# Altium schematic sheet Mic_preamp_schematic.SchDoc
size A4
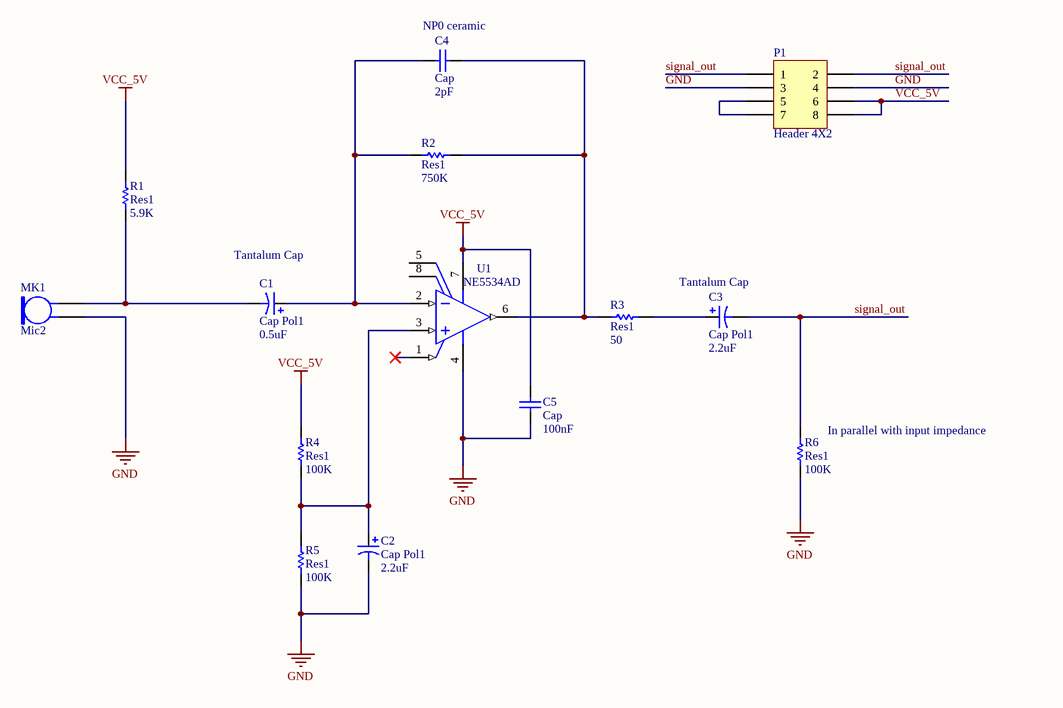
[diagram p0: Mic_preamp_schematic.SchDoc]

## Parts
C1  Cap Pol1  value 0.5uF  [CAPC3216X175N]
C2  Cap Pol1  value 2.2uF  [CAPC3216X175N]
C3  Cap Pol1  value 2.2uF  [CAPC3216X175N]
C4  Cap  value 2pF  [CAPC2012X135N]
C5  Cap  value 100nF  [CAPC2012X135N]
MK1  Mic2  [LD-MC-6035P]
P1  Header 4X2  [HDR2X4]
R1  Res1  value 5.9K  [RESC2012X70N]
R2  Res1  value 750K  [RESC2012X70N]
R3  Res1  value 50  [RESC2012X70N]
R4  Res1  value 100K  [RESC2012X70N]
R5  Res1  value 100K  [RESC2012X70N]
R6  Res1  value 100K  [RESC2012X70N]
U1  NE5534AD  [TI-D8_N]

## Nets
GND: C2.2 C5.1 MK1.1 P1.3 P1.4 R5.2 R6.1 U1.4(VCC-)
VCC_5V: C5.2 P1.6 P1.8 R1.2 R4.1 U1.7(VCC+)
signal_out: C3.2 P1.1 P1.2 R6.2
NetC1_1: C1.1 C4.1 R2.2 U1.2(IN-)
NetC1_2: C1.2 MK1.2 R1.1
NetC2_1: C2.1 R4.2 R5.1 U1.3(IN+)
NetC3_1: C3.1 R3.1
NetC4_2: C4.2 R2.1 R3.2 U1.6(OUT)
NetP1_5: P1.5 P1.7

Not connected (* = marked no-connect by the designer): U1 1(BALANCE)* 5(COMP) 8(COMP/BAL)

## Notes on the sheet
- (near C4) NP0 ceramic
- (near C1) Tantalum Cap
- (near C3) Tantalum Cap
- (near R6) In parallel with input impedance

## Library data of the parts
C1-C3 = Cap Pol1: Polarized Capacitor (Radial); Published: 8-Jun-2000; LatestRevisionDate: 17-Jul-2002; LatestRevisionNote: Re-released for DXP Platform.; PackageReference: RB7.6-15; Publisher: Altium Limited; PackageDescription: Polarized Capacitor (Radial); 2 Leads
C4 C5 = Cap: Capacitor; Published: 8-Jun-2000; LatestRevisionDate: 17-Jul-2002; LatestRevisionNote: Re-released for DXP Platform.; PackageReference: RAD-0.3; Publisher: Altium Limited; PackageDescription: Radial Cap, Thru-Hole; 2 Leads; 0.3 in Pin Spacing
MK1 = Mic2: Microphone; Published: 24-Mar-1999; LatestRevisionDate: 17-Jul-2002; LatestRevisionNote: Re-released for DXP Platform.; PackageReference: PIN2; Publisher: Altium Limited
P1 = Header 4X2: Header, 4-Pin, Dual row; LatestRevisionDate: 17-Jul-2002; LatestRevisionNote: Re-released for DXP Platform.; Publisher: Altium Limited
R1-R6 = Res1: Resistor; Published: 8-Jun-2000; LatestRevisionDate: 17-Jul-2002; LatestRevisionNote: Re-released for DXP Platform.; PackageReference: AXIAL-0.3; Publisher: Altium Limited; PackageDescription: Axial Device, Thru-Hole; 2 Leads; 0.3 in Pin Spacing
U1 = NE5534AD: Low-Noise Operational Amplifier, 10 to 30 V, 0 to 70 degC, 8-pin SOIC (D8), Green (RoHS & no Sb/Br); Manufacturer: Texas Instruments; CMRR(Min)(dB): 70; GBW(Typ)(MHz): 10; IIB(Max)(pA): 1500000; Iq per channel(Max)(mA): 8; Number of Channels: 1; Slew Rate(Typ)(V/us): 13; Sub Family: General Purpose Amplifier, High Supply Voltage Amplifier (>=30V), Low Noise Amp (<=10nV/rtHz); Total Supply Voltage(Max)(+5V is 5, +/-5V is 10): 30; Total Supply Voltage(Min)(+5V is 5, +/-5V is 10): 3.3; Vio (25C)(Max)(mV): 4; Vn at 1kHz(Typ)(nV/rtHz): 3.5; DatasheetVersion: SLOS070C; PackageVersion: 4040047-3/M, 06/2011; PackageReference: D8; PackageDescription: 8-Pin Plastic Small Outline, Body 4.9 x 3.9 mm, Pitch 1.27 mm; Supplier 1: Digi-Key; Supplier Part Number 1: 296-26238-5-ND; Supplier 2: Farnell; Supplier Part Number 2: 9589864; Supplier 3: Newark; Supplier Part Number 3: 08F2508; Supplier 4: Mouser; Supplier Part Number 4: 595-NE5534AD; Eco-Plan: Green (RoHS & no Sb/Br); Mounting Technology: Surface Mount; Code_JEDEC: MS-012; PartNumber: NE5534AD; ComponentLink1Description: Manufacturer URL; ComponentLink1URL: http://www.ti.com/; ComponentLink2Description: Datasheet; ComponentLink2URL: http://www.ti.com/lit/ds/symlink/ne5534a.pdf; ComponentLink3Description: Package Specification; ComponentLink3URL: http://www.ti.com/litv/pdf/msoi002j